# EAGLE design new_PowerBoard_V2 (EAGLE 5.10)
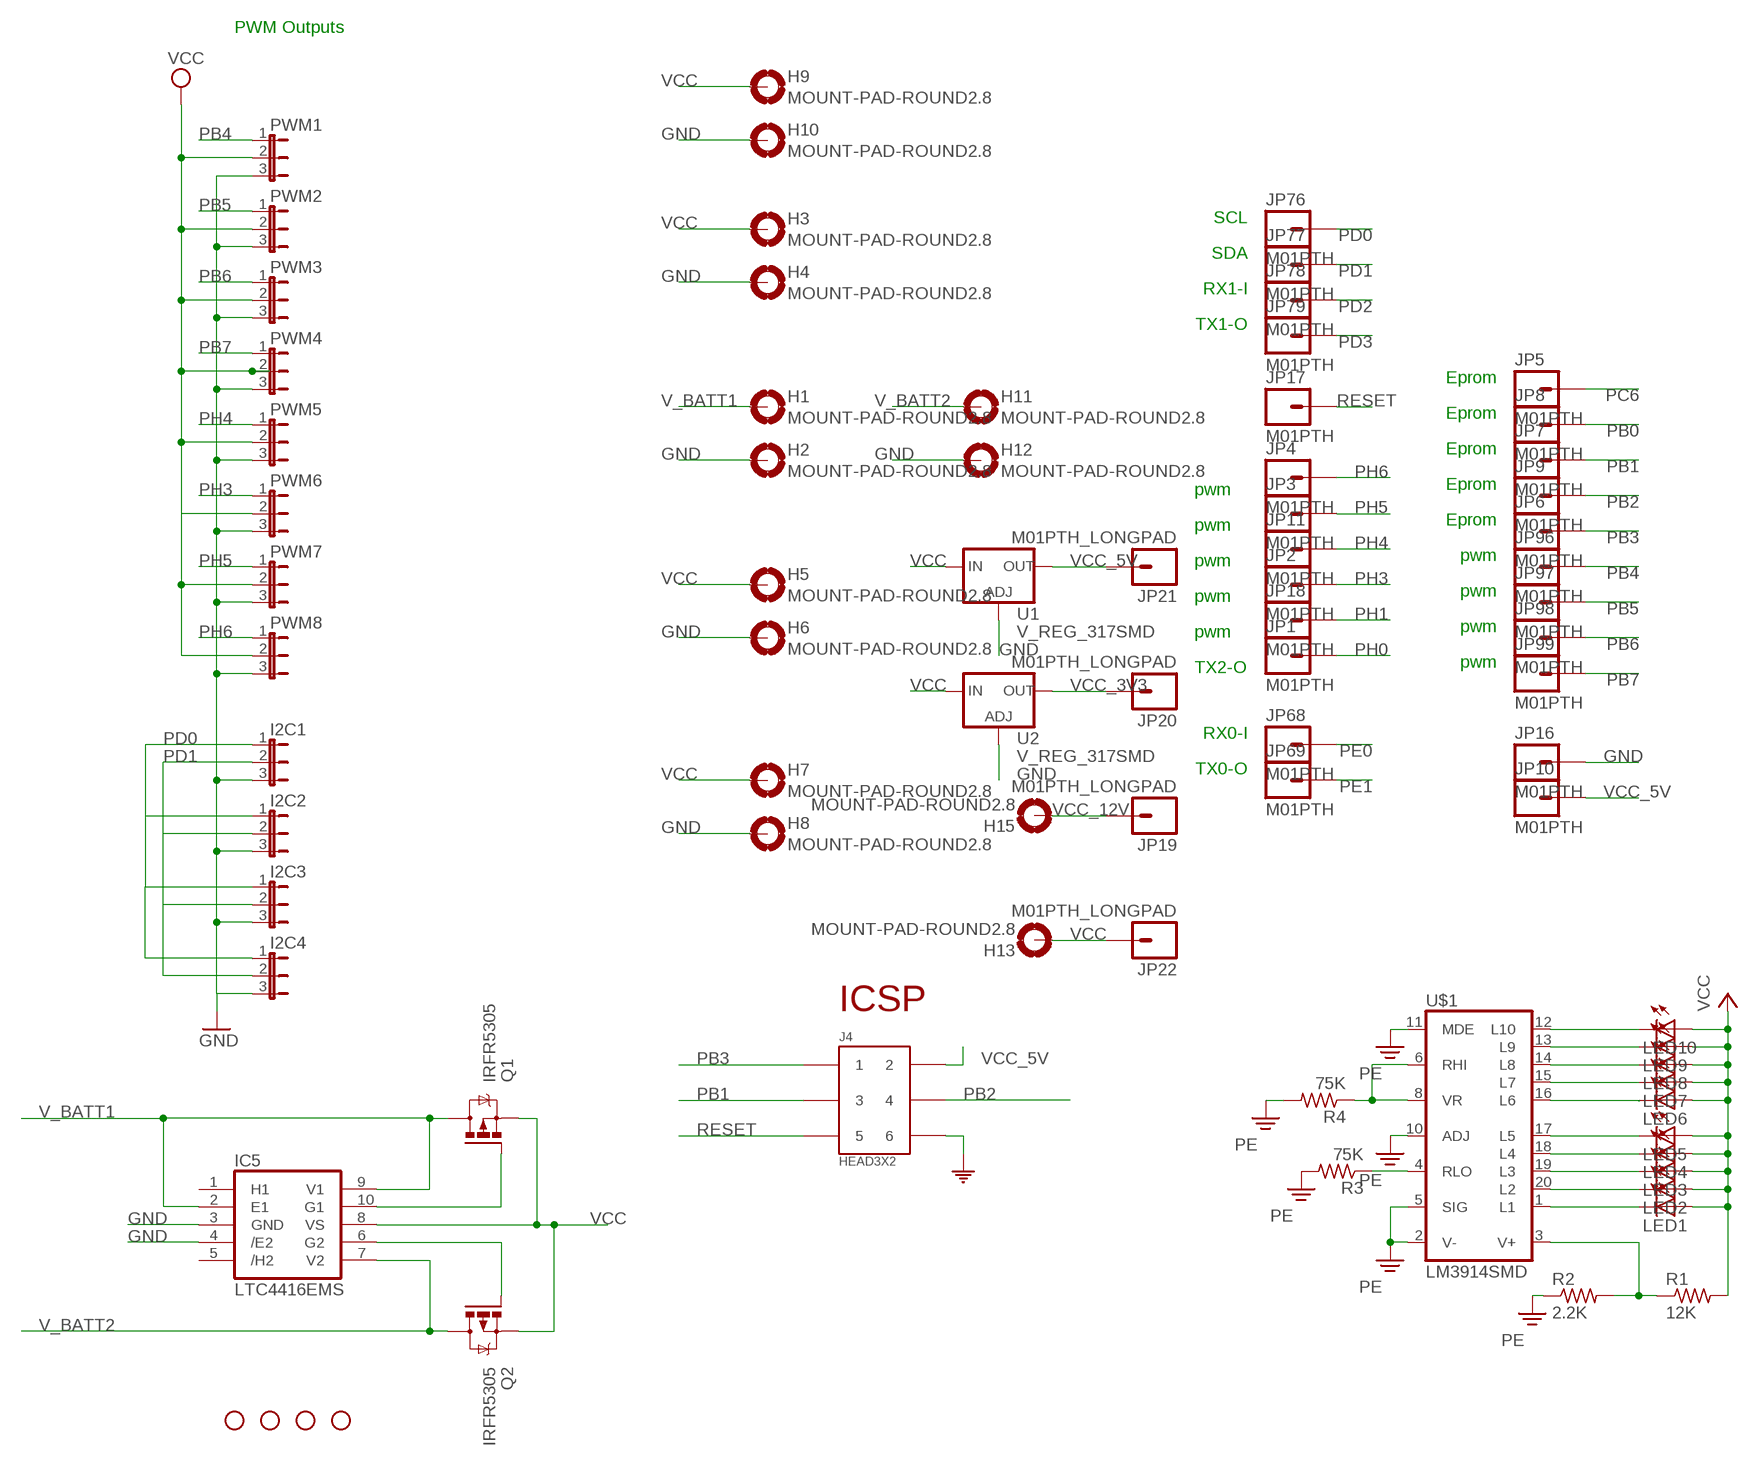
[diagram p0: schematic, sheet 1]

## Parts
H1  MOUNT-PAD-ROUND2.8  [2,8-PAD]
H2  MOUNT-PAD-ROUND2.8  [2,8-PAD]
H3  MOUNT-PAD-ROUND2.8  [2,8-PAD]
H4  MOUNT-PAD-ROUND2.8  [2,8-PAD]
H5  MOUNT-PAD-ROUND2.8  [2,8-PAD]
H6  MOUNT-PAD-ROUND2.8  [2,8-PAD]
H7  MOUNT-PAD-ROUND2.8  [2,8-PAD]
H8  MOUNT-PAD-ROUND2.8  [2,8-PAD]
H9  MOUNT-PAD-ROUND2.8  [2,8-PAD]
H10  MOUNT-PAD-ROUND2.8  [2,8-PAD]
H11  MOUNT-PAD-ROUND2.8  [2,8-PAD]
H12  MOUNT-PAD-ROUND2.8  [2,8-PAD]
H13  MOUNT-PAD-ROUND2.8  [2,8-PAD]
H15  MOUNT-PAD-ROUND2.8  [2,8-PAD]
I2C1  JP2E  [JP2]
I2C2  JP2E  [JP2]
I2C3  JP2E  [JP2]
I2C4  JP2E  [JP2]
IC5  LTC4416EMS  [MSOP10]
J4  HEAD3X2  [HEAD3X2]
JP1  M01PTH  [1X01]
JP2  M01PTH  [1X01]
JP3  M01PTH  [1X01]
JP4  M01PTH  [1X01]
JP5  M01PTH  [1X01]
JP6  M01PTH  [1X01]
JP7  M01PTH  [1X01]
JP8  M01PTH  [1X01]
JP9  M01PTH  [1X01]
JP10  M01PTH  [1X01]
JP11  M01PTH  [1X01]
JP12  STAND-OFF  [STAND-OFF]
JP13  STAND-OFF  [STAND-OFF]
JP14  STAND-OFF  [STAND-OFF]
JP15  STAND-OFF  [STAND-OFF]
JP16  M01PTH  [1X01]
JP17  M01PTH  [1X01]
JP18  M01PTH  [1X01]
JP19  M01PTH_LONGPAD  [1X01_LONGPAD]
JP20  M01PTH_LONGPAD  [1X01_LONGPAD]
JP21  M01PTH_LONGPAD  [1X01_LONGPAD]
JP22  M01PTH_LONGPAD  [1X01_LONGPAD]
JP68  M01PTH  [1X01]
JP69  M01PTH  [1X01]
JP76  M01PTH  [1X01]
JP77  M01PTH  [1X01]
JP78  M01PTH  [1X01]
JP79  M01PTH  [1X01]
JP96  M01PTH  [1X01]
JP97  M01PTH  [1X01]
JP98  M01PTH  [1X01]
JP99  M01PTH  [1X01]
LED1  LEDSMT1206  [1206]
LED2  LEDSMT1206  [1206]
LED3  LEDSMT1206  [1206]
LED4  LEDSMT1206  [1206]
LED5  LEDSMT1206  [1206]
LED6  LEDSMT1206  [1206]
LED7  LEDSMT1206  [1206]
LED8  LEDSMT1206  [1206]
LED9  LEDSMT1206  [1206]
LED10  LEDSMT1206  [1206]
PWM1  JP2E  [JP2]
PWM2  JP2E  [JP2]
PWM3  JP2E  [JP2]
PWM4  JP2E  [JP2]
PWM5  JP2E  [JP2]
PWM6  JP2E  [JP2]
PWM7  JP2E  [JP2]
PWM8  JP2E  [JP2]
Q1  IRFR5305  [D-PAK_TO252AA]
Q2  IRFR5305  [D-PAK_TO252AA]
R1  12K  R-US_R0805  [R0805]
R2  2.2K  R-US_R0805  [R0805]
R3  75K  R-US_R0805  [R0805]
R4  75K  R-US_R0805  [R0805]
U1  V_REG_317SMD  [SOT223]
U2  V_REG_317SMD  [SOT223]
U$1  LM3914SMD  [PLCC20S]

## Nets
GND: H2.B2,8(MOUNT) H4.B2,8(MOUNT) H6.B2,8(MOUNT) H8.B2,8(MOUNT) H10.B2,8(MOUNT) H12.B2,8(MOUNT) I2C1.3 I2C2.3 I2C3.3 I2C4.3 IC5.3(GND) IC5.4(/E2) J4.6 JP16.1 PWM1.3 PWM2.3 PWM3.3 PWM4.3 PWM5.3 PWM6.3 PWM7.3 PWM8.3 U1.1(ADJ) U2.1(ADJ) ; supply symbol labelled COM
N$1: R1.1 R2.2 U$1.3(V+)
N$2: LED10.C U$1.12(L10)
N$3: LED9.C U$1.13(L9)
N$4: LED8.C U$1.14(L8)
N$5: LED7.C U$1.15(L7)
N$7: LED6.C U$1.16(L6)
N$8: LED5.C U$1.17(L5)
N$9: LED4.C U$1.18(L4)
N$10: LED3.C U$1.19(L3)
N$11: LED2.C U$1.20(L2)
N$12: LED1.C U$1.1(L1)
N$13: IC5.10(G1) Q1.1(G)
N$14: R3.1 U$1.4(RLO)
N$15: R4.1 U$1.6(RHI) U$1.8(VR)
N$16: IC5.6(G2) Q2.1(G)
PB0: JP8.1
PB1: J4.3 JP7.1
PB2: J4.4 JP9.1
PB3: J4.1 JP6.1
PB4: JP96.1 PWM1.1
PB5: JP97.1 PWM2.1
PB6: JP98.1 PWM3.1
PB7: JP99.1 PWM4.1
PC6: JP5.1
PD0: I2C1.1 I2C2.1 I2C3.1 I2C4.1 JP76.1
PD1: I2C1.2 I2C2.2 I2C3.2 I2C4.2 JP77.1
PD2: JP78.1
PD3: JP79.1
PE: R2.1 R3.2 R4.2 U$1.2(V-) U$1.5(SIG) U$1.10(ADJ) U$1.11(MDE)
PE0: JP68.1
PE1: JP69.1
PH0: JP1.1
PH1: JP18.1
PH3: JP2.1 PWM6.1
PH4: JP11.1 PWM5.1
PH5: JP3.1 PWM7.1
PH6: JP4.1 PWM8.1
RESET: J4.5 JP17.1
V_BATT1: H1.B2,8(MOUNT) IC5.2(E1) IC5.9(V1) Q1.4(D)
V_BATT2: H11.B2,8(MOUNT) IC5.7(V2) Q2.4(D)
VCC: H3.B2,8(MOUNT) H5.B2,8(MOUNT) H7.B2,8(MOUNT) H9.B2,8(MOUNT) H13.B2,8(MOUNT) IC5.8(VS) JP22.1 LED1.A LED2.A LED3.A LED4.A LED5.A LED6.A LED7.A LED8.A LED9.A LED10.A PWM7.2 PWM8.2 Q1.3(S) Q2.3(S) R1.2 U1.3(IN) U2.3(IN)
VCC_3V3: JP20.1 U2.2(OUT)
VCC_5V: J4.2 JP10.1 JP21.1 PWM1.2 PWM2.2 PWM3.2 PWM4.2 PWM5.2 PWM6.2 U1.2(OUT) ; supply symbol labelled VCC
VCC_12V: H15.B2,8(MOUNT) JP19.1
Unconnected: IC5.1(H1) IC5.5(/H2)

## Notes on the sheet
- PWM Outputs
- SCL
- SDA
- RX1-I
- TX1-O
- Eprom
- Eprom
- Eprom
- Eprom
- pwm
- Eprom
- pwm
- pwm
- pwm
- pwm
- pwm
- pwm
- pwm
- pwm
- TX2-O
- RX0-I
- TX0-O
- ICSP

## Library data of the parts
H1-H13 H15 = holes:MOUNT-PAD-ROUND: MOUNTING PAD, round
I2C1-I2C4 PWM1-PWM8 = jumper:JP2E: JUMPER
IC5 = linear-technology-3:LTC4416*: Low Loss Dual PowerPath Controllers
J4 = MyCON2:HEAD3X2
JP1-JP11 JP16-JP18 JP68 JP69 JP76-JP79 JP96-JP99 = DIYdrones3:M01: Header 1 Standard 1-pin 0.1" header. Use with straight break away headers (SKU : PRT-00116), right angle break away headers (PRT-00553), swiss pins (PRT-00743), machine pins (PRT-00117), and female headers (PRT-00115).
JP12-JP15 = SparkFun:STAND-OFF: Stand Off This is the mechanical footprint for a #4 phillips button head screw. Use the keepout ring to avoid running the screw head into surrounding components. SKU : PRT-00447
JP19-JP22 = SparkFun:M01: Header 1 Standard 1-pin 0.1" header. Use with straight break away headers (SKU : PRT-00116), right angle break away headers (PRT-00553), swiss pins (PRT-00743), machine pins (PRT-00117), and female headers (PRT-00115).
LED1-LED10 = led:LED: LED OSRAM: - CHIPLED LG R971, LG N971, LY N971, LG Q971, LY Q971, LO R971, LY R971 LH N974, LH R974 LS Q976, LO Q976, LY Q976 LO Q996 - Hyper CHIPLED LW Q18S LB Q993, LB Q99A, LB R99A - SideLED LS A670, LO A670, LY A670, LG A670, LP A670 LB A673, LV A673, LT A673, LW A673 LH A674 LY A675 LS A676, LA A676, LO A676, LY A676, LW A676 LS A679, LY A679, LG A679 - Hyper Micro SIDELED® LS Y876, LA Y876, LO Y876, LY Y876 LT Y87S - SmartLED LW L88C, LW L88S LB L89C, LB L89S, LG L890 LS L89K, LO L89K, LY L89K LS L896, LA L896, LO L896, LY L896 - TOPLED LS T670, LO T670, LY T670, LG T670, LP T670 LSG T670, LSP T670, LSY T670, LOP T670, LYG T670 LG T671, LOG T671, LSG T671 LB T673, LV T673, LT T673, LW T673 LH T674 LS T676, LA T676, LO T676, LY T676, LB T676, LH T676, LSB T676, LW T676 LB T67C, LV T67C, LT T67C, LS T67K, LO T67K, LY T67K, LW E67C LS E67B, LA E67B, LO E67B, LY E67B, LB E67C, LV E67C, LT E67C LW T67C LS T679, LY T679, LG T679 LS T770, LO T770, LY T770, LG T770, LP T770 LB T773, LV T773, LT T773, LW T773 LH T774 LS E675, LA E675, LY E675, LS T675 LS T776, LA T776, LO T776, LY T776, LB T776 LHGB T686 LT T68C, LB T68C - Hyper Mini TOPLED® LB M676 - Mini TOPLED Santana® LG M470 LS M47K, LO M47K, LY M47K Source: http://www.osram.convergy.de LUXEON: - LUMILED® LXK2-PW12-R00, LXK2-PW12-S00, LXK2-PW14-U00, LXK2-PW14-V00 LXK2-PM12-R00, LXK2-PM12-S00, LXK2-PM14-U00 LXK2-PE12-Q00, LXK2-PE12-R00, LXK2-PE12-S00, LXK2-PE14-T00, LXK2-PE14-U00 LXK2-PB12-K00, LXK2-PB12-L00, LXK2-PB12-M00, LXK2-PB14-N00, LXK2-PB14-P00, LXK2-PB14-Q00 LXK2-PR12-L00, LXK2-PR12-M00, LXK2-PR14-Q00, LXK2-PR14-R00 LXK2-PD12-Q00, LXK2-PD12-R00, LXK2-PD12-S00 LXK2-PH12-R00, LXK2-PH12-S00 LXK2-PL12-P00, LXK2-PL12-Q00, LXK2-PL12-R00 Source: www.luxeon.com KINGBRIGHT: KA-3528ASYC Source: www.kingbright.com
Q1 Q2 = transistor-power:IRF?5305: HEXFET Power MOSFET Source: http://www.irf.com/product-info/datasheets/data/irfr5305pbf.pdf
R1-R4 = resistor:R-US_: RESISTOR, American symbol
U1 U2 = SparkFun:V_REG_317: Voltage Regulator Standard LM317 adjustable voltage regulator. AOI (Adjust Output Input). Google 'LM317 Calculator' for easy to use app to get the two resistor values needed. 240/720 for 5V output. 240/390 for 3.3V output. Spark Fun Electronics SKU : COM-00527
U$1 = linear:LM3914SMD

## Board
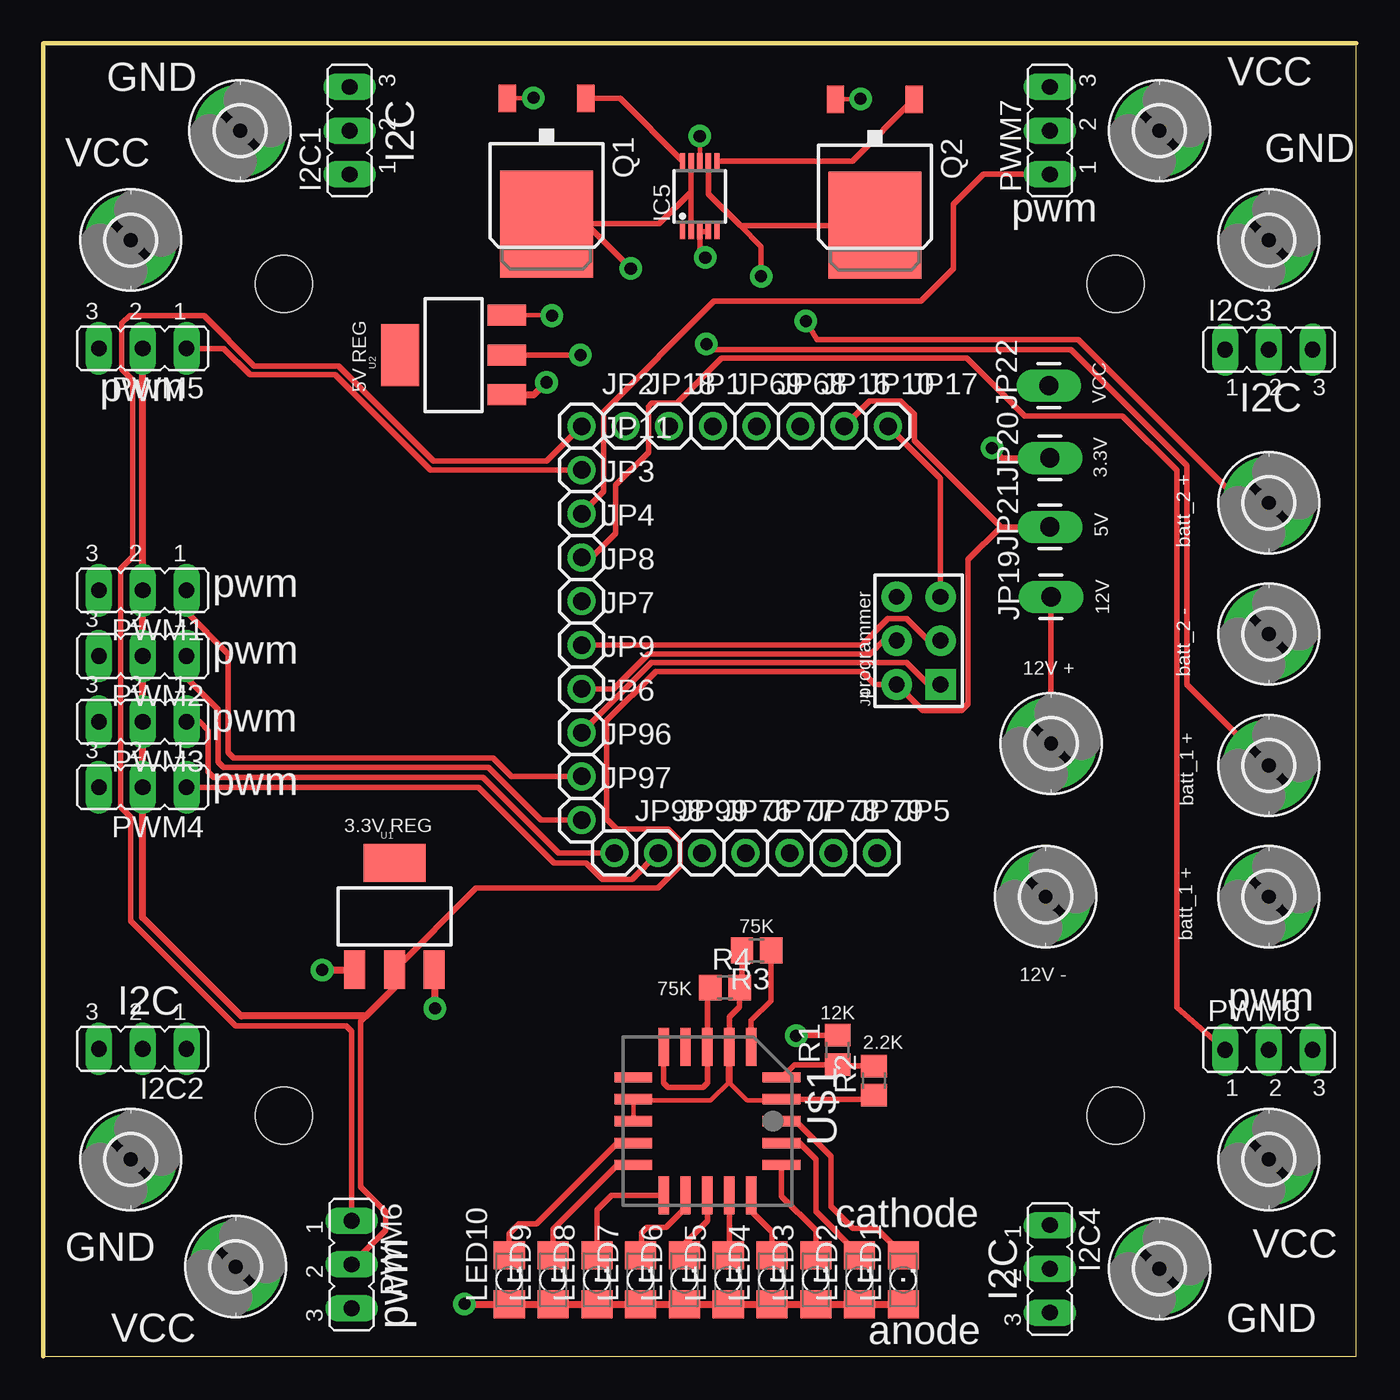
[diagram p1: board, top side]
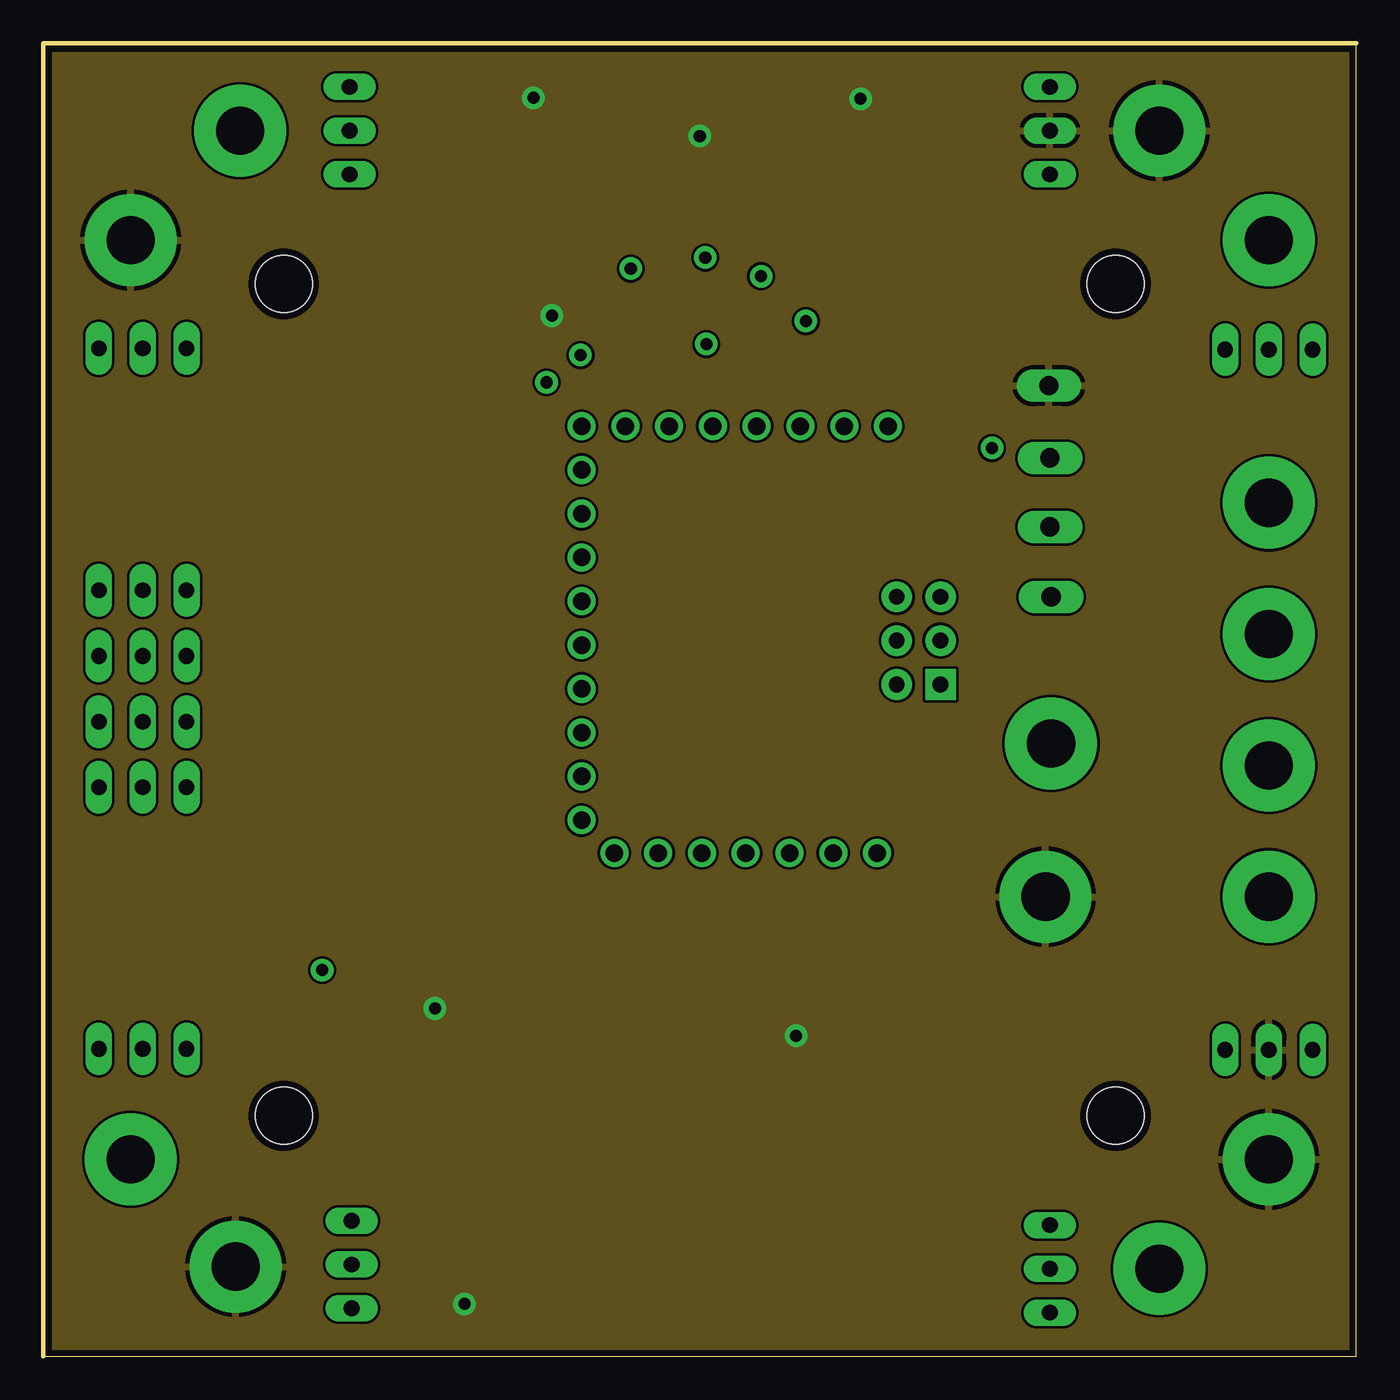
[diagram p2: board, inner layer VCC]
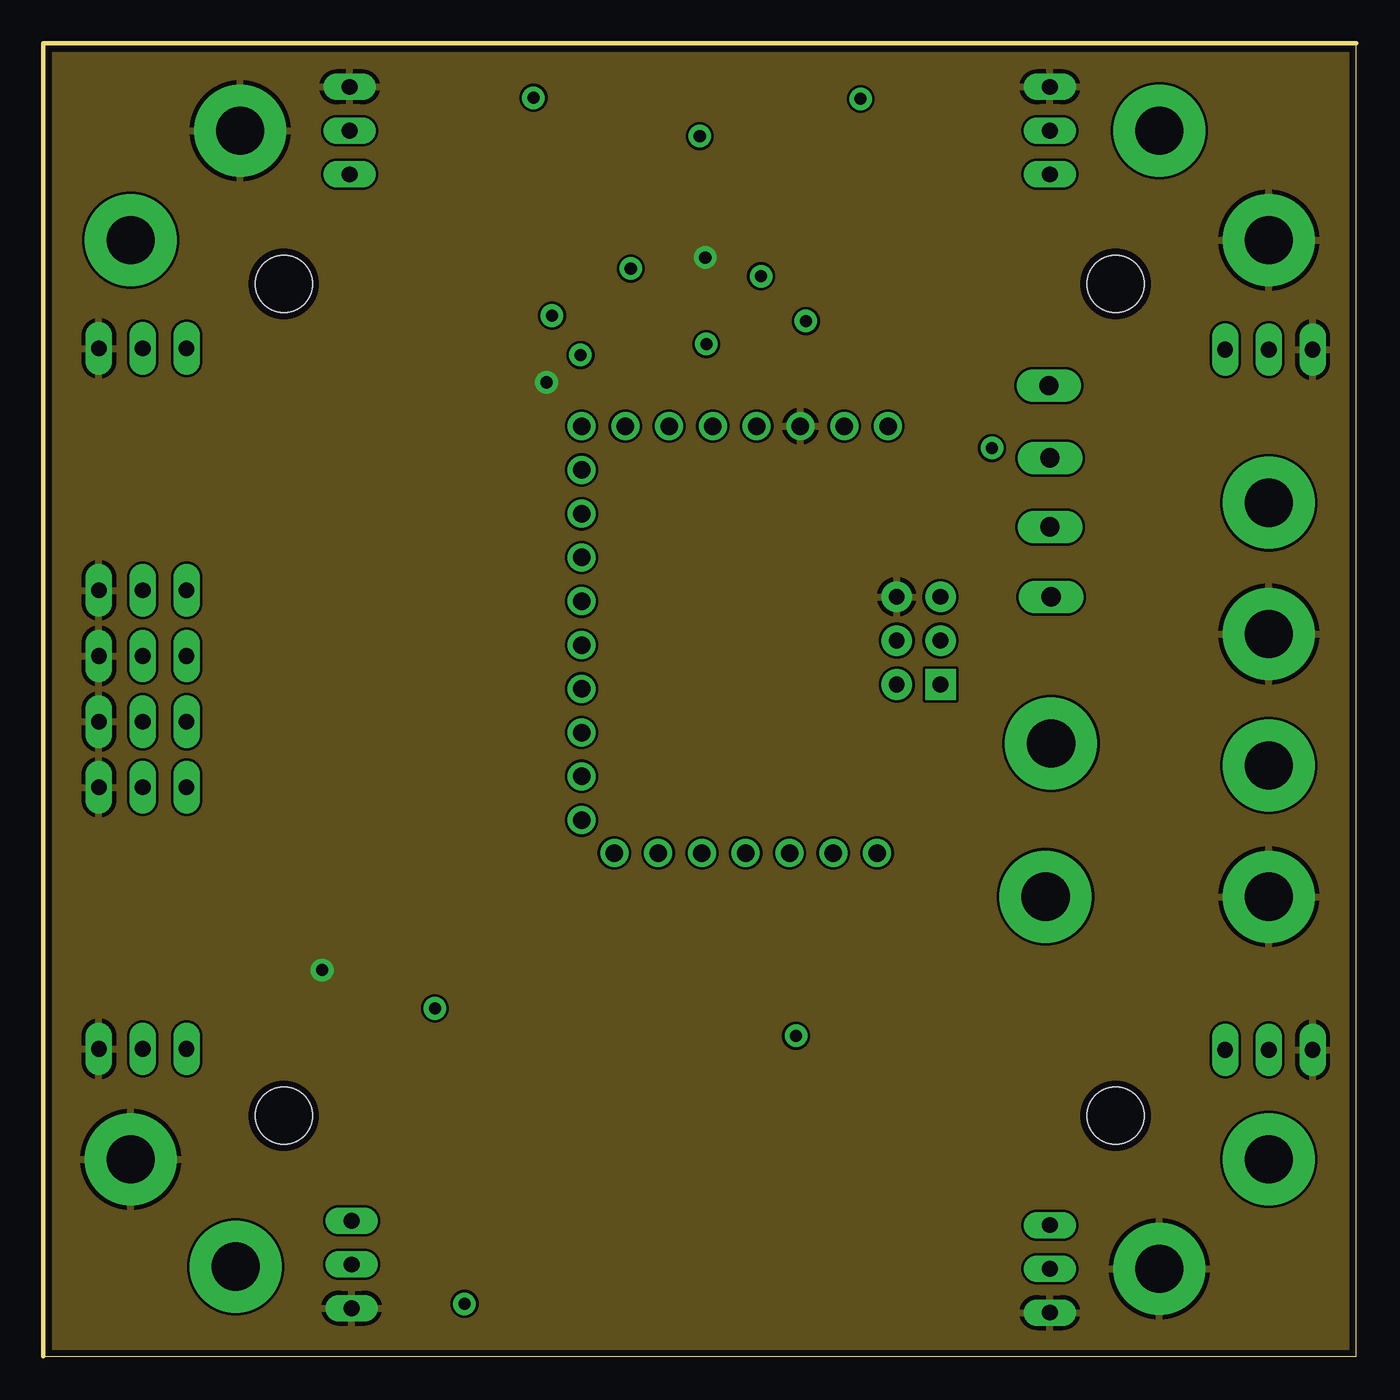
[diagram p3: board, inner layer GND]
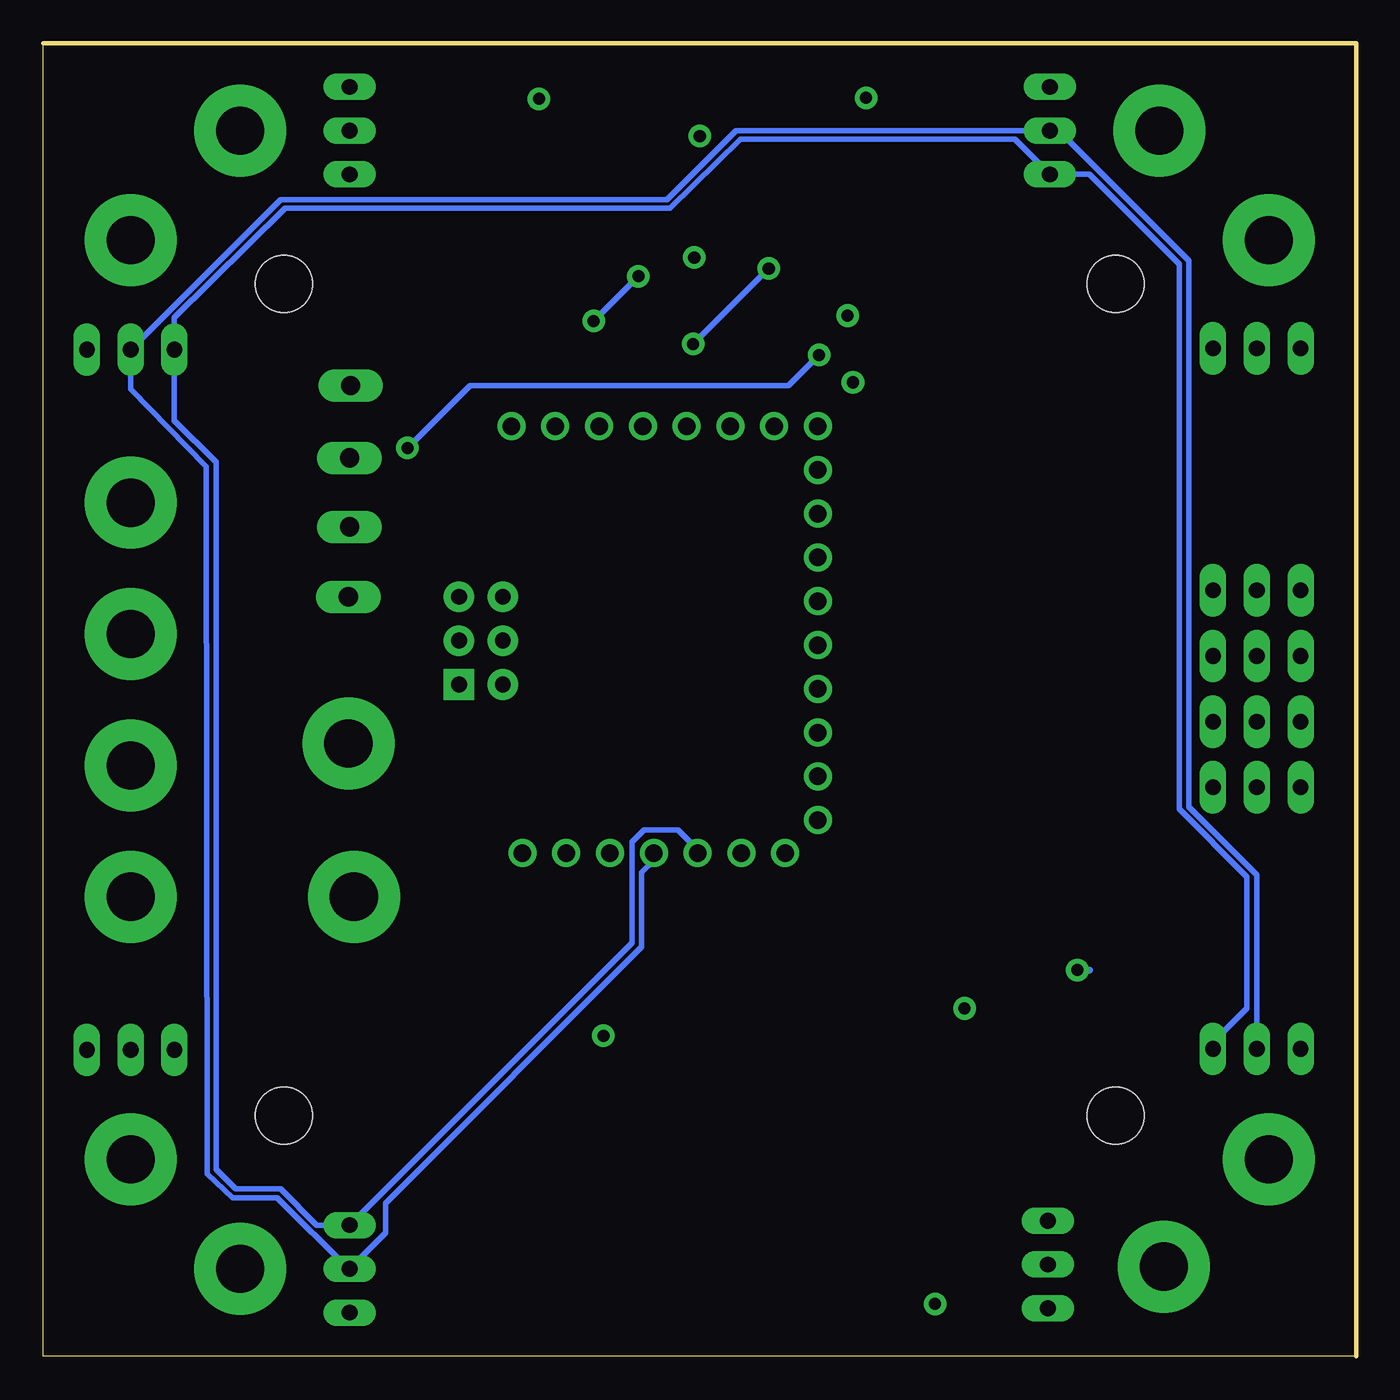
[diagram p4: board, bottom side, seen from below]

Size 76.2 x 76.2 mm. Coordinates in mm from the lower left corner, seen from the top.
Outline: 0,0 76.2,0 76.2,76.2 0,76.2 0,0
Copper layers (1*2*15*16): Top 0.0356mm / dielectric 1.5011mm / VCC 0.0356mm / dielectric 0.1499mm / GND 0.0356mm / dielectric 0.2007mm / Bottom 0.0356mm
Design rules "Aerial-4Layer": minimum track width 10mil, minimum drill 15mil, track to track 6mil, track to pad 6mil, pad to pad 6mil, via to via 12mil, smd to smd 6mil, copper to edge 15mil, drill to drill 8mil, minimum pad ring 12mil, minimum via ring 12mil, stop-mask expansion 4mil, vias tented up to drill 0mil, thermal gap 10mil

### Footprints (pad centres in the part's own frame; a part is rotated, then mirrored left to right if it is on the bottom)
2,8-PAD = drill 2.8 pad 5.334 round: B2,8 0,0
JP2 = drill 0.914 long: 1 -2.54,0; 2 0,0; 3 2.54,0
MSOP10 = smd 0.31 x 0.9: 1 -1,-2.05; 2 -0.5,-2.05; 3 0,-2.05; 4 0.5,-2.05; 5 1,-2.05; 6 1,2.05; 7 0.5,2.05; 8 0,2.05; 9 -0.5,2.05; 10 -1,2.05
HEAD3X2 = drill 0.914 pad 1.778 square: 1 0,0 | drill 0.914 pad 1.778 round: 2 0,2.54; 3 2.54,0; 4 2.54,2.54; 5 5.08,0; 6 5.08,2.54
1X01 = drill 1.016 round: 1 0,0
STAND-OFF = hole 3.302: 0,0
1X01_LONGPAD = drill 1.118 pad 1.88 long: 1 0,0
1206 = smd 1.6 x 1.803: A -1.422,0; C 1.422,0
D-PAK_TO252AA = smd 1 x 1.6: 1 -2.28,-4.8; 3 2.28,-4.8 | smd 5.4 x 6.2: 4 0,2.5
R0805 = smd 1.3 x 1.5: 1 -0.85,0; 2 0.85,0
SOT223 = smd 1.219 x 2.235: 1 -2.311,-3.099; 2 0,-3.099; 3 2.311,-3.099 | smd 3.6 x 2.2: 4 0,3.099
PLCC20S = smd 0.6 x 2.2: 1 0,4.3; 2 -1.27,4.3; 3 -2.54,4.3; 9 -2.54,-4.3; 10 -1.27,-4.3; 11 0,-4.3; 12 1.27,-4.3; 13 2.54,-4.3; 19 2.54,4.3; 20 1.27,4.3 | smd 2.2 x 0.6: 4 -4.3,2.54; 5 -4.3,1.27; 6 -4.3,0; 7 -4.3,-1.27; 8 -4.3,-2.54; 14 4.3,-2.54; 15 4.3,-1.27; 16 4.3,0; 17 4.3,1.27; 18 4.3,2.54

### Placement (x,y rotation side)
H1  71.12,34.29 0 top
H2  71.12,26.67 0 top
H3  71.12,11.43 0 top
H4  64.77,5.08 0 top
H5  64.77,71.12 0 top
H6  71.12,64.77 0 top
H7  5.08,64.77 0 top
H8  11.43,71.12 0 top
H9  11.18,5.21 0 top
H10  5.08,11.43 0 top
H11  71.12,49.53 0 top
H12  71.12,41.91 0 top
H13  58.17,26.67 0 top
H15  58.48,35.56 0 top
I2C1  17.78,71.12 90 top
I2C2  5.78,17.84 180 top
I2C3  71.12,58.42 0 top
I2C4  58.42,5.08 270 top
IC5  38.1,67.31 0 top
J4  52.07,38.99 90 top
JP1  36.32,53.98 0 top
JP2  31.24,53.98 0 top
JP3  31.24,48.9 0 top
JP4  31.24,46.35 0 top
JP5  48.39,29.21 0 top
JP6  31.24,36.2 0 top
JP7  31.24,41.27 0 top
JP8  31.24,43.81 0 top
JP9  31.24,38.73 0 top
JP10  46.48,53.98 0 top
JP11  31.24,51.44 0 top
JP12  62.23,13.97 0 top
JP13  13.97,13.97 0 top
JP14  62.23,62.23 0 top
JP15  13.97,62.23 0 top
JP16  43.94,53.98 0 top
JP17  49.02,53.98 0 top
JP18  33.78,53.98 0 top
JP19  58.48,44.07 90 top
JP20  58.42,52.13 90 top
JP21  58.42,48.13 90 top
JP22  58.36,56.32 90 top
JP68  41.4,53.98 0 top
JP69  38.86,53.98 0 top
JP76  38.23,29.21 0 top
JP77  40.77,29.21 0 top
JP78  43.31,29.21 0 top
JP79  45.85,29.21 0 top
JP96  31.24,33.66 0 top
JP97  31.24,31.11 0 top
JP98  33.15,29.21 0 top
JP99  35.69,29.21 0 top
LED1  49.91,4.45 90 top
LED2  47.37,4.45 90 top
LED3  44.83,4.45 90 top
LED4  42.29,4.45 90 top
LED5  39.75,4.45 90 top
LED6  37.21,4.45 90 top
LED7  34.67,4.45 90 top
LED8  32.13,4.45 90 top
LED9  29.59,4.45 90 top
LED10  27.05,4.45 90 top
PWM1  5.78,44.45 180 top
PWM2  5.78,40.64 180 top
PWM3  5.78,36.83 180 top
PWM4  5.78,33.02 180 top
PWM5  5.78,58.48 180 top
PWM6  17.91,5.33 270 top
PWM7  58.42,71.12 90 top
PWM8  71.12,17.78 0 top
Q1  29.21,68.2 180 top
Q2  48.26,68.14 180 top
R1  46.1,17.78 90 top
R2  48.2,16 90 top
R3  41.4,23.56 180 top
R4  39.56,21.4 0 top
U1  20.38,25.53 0 top
U2  23.81,58.1 90 top
U$1  38.54,13.65 270 top

### Tracks (layer width: path | path; a pad name or v marks a point on that pad's centre or on a via)
GND  (via drill 0.7)
  Top 0.305: IC5.4 IC5.3 38.1,64.07 v38.42,63.75
  Top 0.406: U2.1 28.49,55.79 v29.21,56.52 | U1.1 v16.19,22.43 v16.19,22.42
  GND 0.305: v38.42,63.75 38.48,63.69
  Bottom 0.406: v29.21,56.52 29.21,56.58 29.46,56.83 | v16.19,22.42 15.49,22.42
  pour GND: -0.44,76.9 77.34,76.9 77.34,-1.21 -0.44,-1.21
N$1
  Top 0.305: R2.2 46.18,16.85 R1.1 43.58,16.93 U$1.3
N$2
  Top 0.305: U$1.12 33.34,12.38 28.64,7.68 27.62,7.68 27.05,7.11 LED10.C
N$3
  Top 0.305: U$1.13 33.34,11.11 29.59,7.37 LED9.C
N$4
  Top 0.305: U$1.14 32.97,9.35 32.13,8.51 LED8.C
N$5
  Top 0.305: U$1.15 37.27,8.64 36.13,7.49 35.05,7.49 34.73,7.18 34.73,5.93 LED7.C
N$7
  Top 0.305: U$1.16 38.54,7.87 37.27,6.6 37.27,5.93 LED6.C
N$8
  Top 0.305: U$1.17 39.81,5.93 LED5.C
N$9
  Top 0.305: U$1.18 41.08,8.45 42.29,7.24 LED4.C
N$10
  Top 0.305: U$1.19 42.84,9.29 44.83,7.3 LED3.C
N$11
  Top 0.305: U$1.20 43.88,12.38 44.83,11.43 44.83,8.41 LED2.C
N$12
  Top 0.305: U$1.1 43.69,13.65 45.72,11.62 45.72,8.7 46.99,7.43 48.35,7.43 LED1.C
N$13
  Top 0.305: Q1.1 33.46,73 IC5.10
N$14
  Top 0.305: U$1.4 41.08,19.49 42.23,20.64 42.23,23.53 R3.1
N$15
  Top 0.305: R4.1 38.54,21.23 U$1.6 38.54,15.88 38.29,15.62 36.26,15.62 36.01,15.88 U$1.8
N$16
  Top 0.305: IC5.6 46.97,69.36 Q2.1
PB1
  Top 0.305: J4.3 51.37,41.53 50.1,42.8 49.02,42.8 47.5,41.27 JP7.1
PB2
  Top 0.305: J4.4 48.77,41.53 48.01,40.77 35.12,40.77 33.08,38.73 JP9.1
PB3
  Top 0.305: J4.1 51.37,38.99 50.1,40.26 35.31,40.26 JP6.1
PB4
  Top 0.305: JP96.1 27.18,33.66 26.1,34.73 11.05,34.73 10.73,35.05 10.73,40.77 8.32,43.18 PWM1.1
PB5
  Top 0.305: JP97.1 28.89,31.11 25.84,34.16 10.48,34.16 10.16,34.48 10.16,37.53 8.32,39.37 PWM2.1
PB6
  Top 0.305: JP98.1 29.91,29.21 25.53,33.59 9.91,33.59 9.59,33.91 9.59,36.32 9.08,36.83 PWM3.1
PB7
  Top 0.305: PWM4.1 25.27,33.02 29.65,28.64 31.5,28.64 32.45,27.69 34.16,27.69 JP99.1
PD0
  Bottom 0.305: I2C2.1 8.32,18.22 6.35,20.19 6.35,27.81 10.29,31.75 10.29,63.37 15.49,68.58 I2C1.1 19.81,70.61 35.75,70.61 39.81,66.61 62.17,66.61 68.58,60.26 I2C3.1 68.58,54.29 66.17,51.88 66.17,10.86 65.02,9.72 62.42,9.72 60.33,7.62 I2C4.1 42.04,24 42.04,29.84 41.34,30.54 39.37,30.54 38.23,29.4 JP76.1
PD1
  Bottom 0.305: I2C2.2 5.78,27.94 9.72,31.88 9.72,63.56 17.27,71.12 I2C1.2 36.01,71.12 40.01,67.12 62.42,67.12 I2C3.2 71.12,56.13 66.74,51.63 66.67,10.6 65.22,9.21 62.61,9.21 58.48,5.08 I2C4.2 56.33,7.18 56.33,8.89 41.47,23.75 41.47,28.07 40.77,28.77 JP77.1
PE
  Top 0.254: U$1.11 U$1.10 | 39.81,15.94 38.73,14.86 34.31,14.86 | U$1.5 39.81,15.88 40.83,14.86 42.78,14.86
  Top 0.305: U$1.2 47.97,14.92 R2.1 | R3.2 40.55,21.54 R4.2 40.41,20.28 39.81,19.68 U$1.5
  Top 0.406: 39.81,15.94 U$1.5 | U$1.10 34.31,14.86 | 42.78,14.86 U$1.2
PH3
  Top 0.305: PWM6.1 17.91,18.86 17.59,19.18 11.18,19.18 5.08,25.27 5.08,31.3 4.51,31.88 4.51,45.72 5.21,46.42 5.21,56.64 4.57,57.28 4.57,59.94 5.02,60.39 9.34,60.39 12.26,57.47 17.14,57.47 22.67,51.94 29.21,51.94 JP2.1
PH4
  Top 0.305: PWM5.1 10.48,58.48 12,56.96 16.95,56.96 22.48,51.44 JP11.1
PH5
  Top 0.305: PWM7.1 54.55,68.58 52.83,66.86 52.83,63.12 50.93,61.21 38.92,61.21 32.51,54.8 32.51,50.16 JP3.1
PH6
  Top 0.305: PWM8.1 65.79,20.26 65.79,51.44 62.61,54.55 56.96,54.55 53.59,57.91 39.37,57.91 36.77,55.31 35.31,55.31 35.12,55.12 35.12,52.45 33.21,50.55 33.21,47.75 31.81,46.35 JP4.1
RESET
  Top 0.305: J4.5 52.07,50.93 JP17.1
V_BATT1  (via drill 0.7)
  Top 0.305: IC5.9 IC5.2 37.6,67.62 37.59,67.63 37.59,67.56 35.75,65.72 29.23,65.72 Q1.4 31.52,65.7 v34.1,63.12 | H1.B2,8 71.06,34.29 66.36,38.99 66.36,51.69 59.63,58.42 38.8,58.42 v38.48,58.74
  Bottom 0.305: v34.1,63.12 v38.48,58.74
V_BATT2  (via drill 0.7)
  Top 0.305: IC5.7 38.6,67.44 40.45,65.6 | 40.45,65.6 48.22,65.6 Q2.4 | H11.B2,8 69.53,49.53 60.07,58.99 44.9,58.99 v44.26,60.07 | v41.66,62.67 41.66,64.39 40.45,65.6
  Bottom 0.305: v41.66,62.67 v44.26,60.07
VCC  (via drill 0.7)
  Top 0.254: IC5.8 v38.1,70.8 | Q2.3 47.43,72.94 v47.43,72.96 | Q1.3 28.45,73 v28.45,73.03 | U2.3 29.53,60.41 v29.53,60.39
  Top 0.305: R1.2 43.71,18.63 v43.69,18.61
  Top 0.406: v24.45,3.05 24.45,3.02 LED10.A LED9.A LED8.A LED7.A LED6.A LED5.A LED4.A LED3.A LED2.A LED1.A | U1.3 22.73,22.43 v22.73,20.19
  VCC 0.254: v38.1,70.8 38.1,70.87 | v47.43,72.96 47.5,72.96 | v28.45,73.03 28.57,73.03 | v29.53,60.39 29.59,60.39
  VCC 0.305: v43.69,18.61 43.62,18.54
  VCC 0.406: v24.45,3.05 24.38,3.05 | v22.73,20.19 22.73,20.13
  pour VCC: -0.64,77.09 77.34,77.09 77.34,-1.33 -0.64,-1.33
VCC_3V3  (via drill 0.7)
  Top 0.305: JP20.1 55.63,52.13 v55.05,52.7 | U2.2 v31.18,58.1
  Bottom 0.305: v55.05,52.7 51.44,56.33 32.96,56.33 v31.18,58.1
VCC_5V
  Top 0.305: 55.56,48.13 JP21.1 | 55.56,48.13 50.55,53.15 50.55,54.67 49.78,55.44 47.94,55.44 JP10.1 | 55.56,48.13 53.66,46.23 53.66,37.85 53.28,37.47 51.05,37.47 J4.2 48.26,38.99 47.5,39.75 35.56,39.75 32.7,36.89 32.7,31.18 33.27,30.61 36.26,30.61 36.96,29.91 36.96,28.45 35.69,27.18 25.13,27.18 U1.2 | PWM6.2 19.88,7.3 19.88,8.38 18.41,9.84 18.41,19.43 18.73,19.75
  Top 0.406: PWM5.2 PWM1.2 PWM2.2 PWM3.2 PWM4.2 5.78,25.46 11.49,19.75 18.73,19.75 20.38,21.4 U1.2
VCC_12V
  Top 0.305: H15.B2,8 JP19.1

### Text on the board
tPlace: VCC | GND | VCC | I2C | GND | pwm | pwm | 5V REG | VCC | I2C | 3.3V | 5V | batt_2 + | pwm | 12V | pwm | 12V + | batt_2 - | pwm | programmer | pwm | batt_1 + | 3.3V REG | 75K | batt_1 + | 12V - | pwm | 75K | I2C | 12K | 2.2K | cathode | GND | VCC | I2C | pwm | VCC | anode | GND
Reference: VCC | GND